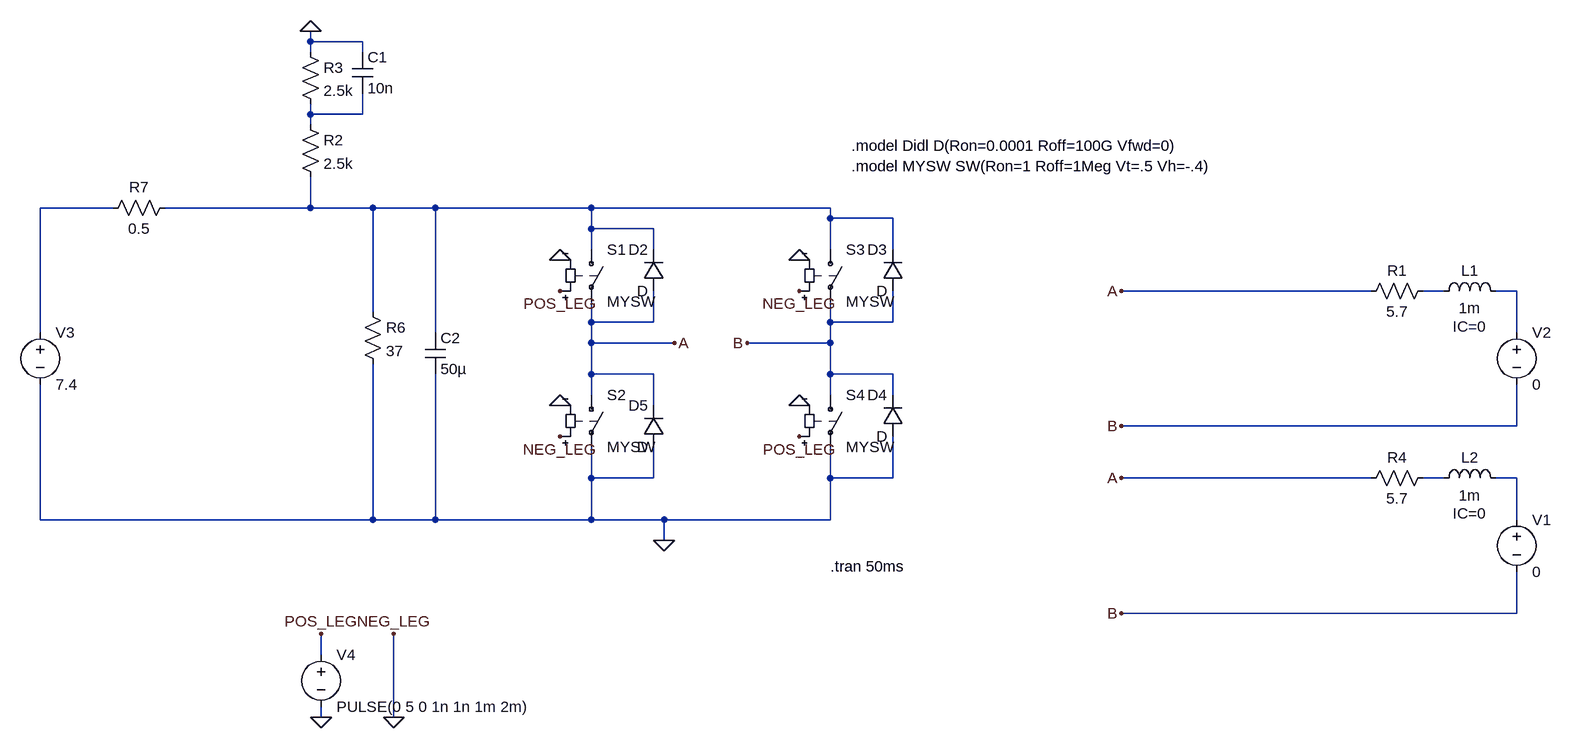
[diagram p0: schematic current-reading.asc]
current-reading.asc, the LTspice schematic file:
Version 4
SHEET 1 1304 740
WIRE -768 -416 -768 -432
WIRE -688 -416 -768 -416
WIRE -768 -400 -768 -416
WIRE -688 -400 -688 -416
WIRE -768 -304 -768 -320
WIRE -688 -304 -688 -336
WIRE -688 -304 -768 -304
WIRE -768 -288 -768 -304
WIRE -1072 -160 -1184 -160
WIRE -768 -160 -768 -208
WIRE -768 -160 -992 -160
WIRE -672 -160 -768 -160
WIRE -576 -160 -672 -160
WIRE -336 -160 -576 -160
WIRE 32 -160 -336 -160
WIRE 32 -144 32 -160
WIRE 128 -144 32 -144
WIRE -336 -128 -336 -160
WIRE -240 -128 -336 -128
WIRE -336 -96 -336 -128
WIRE -240 -96 -240 -128
WIRE 32 -96 32 -144
WIRE 128 -96 128 -144
WIRE 864 -32 480 -32
WIRE 976 -32 944 -32
WIRE 1088 -32 1056 -32
WIRE -672 0 -672 -160
WIRE -336 16 -336 -16
WIRE -240 16 -240 -32
WIRE -240 16 -336 16
WIRE 32 16 32 -16
WIRE 128 16 128 -32
WIRE 128 16 32 16
WIRE -1184 32 -1184 -160
WIRE -576 32 -576 -160
WIRE 1088 32 1088 -32
WIRE -336 48 -336 16
WIRE -208 48 -336 48
WIRE 32 48 32 16
WIRE 32 48 -96 48
WIRE -336 96 -336 48
WIRE -240 96 -336 96
WIRE 32 96 32 48
WIRE 128 96 32 96
WIRE -336 128 -336 96
WIRE 32 128 32 96
WIRE 128 128 128 96
WIRE -240 144 -240 96
WIRE 1088 176 1088 112
WIRE 1088 176 480 176
WIRE -336 256 -336 208
WIRE -240 256 -240 208
WIRE -240 256 -336 256
WIRE 32 256 32 208
WIRE 128 256 128 192
WIRE 128 256 32 256
WIRE 864 256 480 256
WIRE 976 256 944 256
WIRE 1088 256 1056 256
WIRE -1184 320 -1184 112
WIRE -672 320 -672 80
WIRE -672 320 -1184 320
WIRE -576 320 -576 96
WIRE -576 320 -672 320
WIRE -336 320 -336 256
WIRE -336 320 -576 320
WIRE -224 320 -336 320
WIRE 32 320 32 256
WIRE 32 320 -224 320
WIRE 1088 320 1088 256
WIRE -224 352 -224 320
WIRE 1088 464 1088 400
WIRE 1088 464 480 464
WIRE -752 528 -752 496
WIRE -752 624 -752 608
WIRE -640 624 -640 496
FLAG -224 352 0
FLAG -384 -80 0
FLAG -384 144 0
FLAG -16 144 0
FLAG -16 -80 0
FLAG -640 624 0
FLAG -752 624 0
FLAG -752 496 POS_LEG
FLAG -640 496 NEG_LEG
FLAG -384 -32 POS_LEG
FLAG -16 192 POS_LEG
FLAG -384 192 NEG_LEG
FLAG -16 -32 NEG_LEG
FLAG -208 48 A
FLAG -96 48 B
FLAG 480 -32 A
FLAG 480 176 B
FLAG -768 -432 0
FLAG 480 256 A
FLAG 480 464 B
SYMBOL voltage 1088 16 R0
WINDOW 123 0 0 Left 0
WINDOW 39 0 0 Left 0
SYMATTR InstName V2
SYMATTR Value 0
SYMBOL res 960 -48 R90
WINDOW 0 0 56 VBottom 2
WINDOW 3 32 56 VTop 2
SYMATTR InstName R1
SYMATTR Value 5.7
SYMBOL ind 960 -16 R270
WINDOW 0 32 56 VTop 2
WINDOW 3 5 56 VBottom 2
WINDOW 39 -23 56 VBottom 2
SYMATTR InstName L1
SYMATTR Value 1m
SYMATTR SpiceLine IC=0
SYMBOL sw -336 -112 R0
SYMATTR InstName S1
SYMATTR Value MYSW
SYMBOL sw -336 112 R0
SYMATTR InstName S2
SYMATTR Value MYSW
SYMBOL sw 32 -112 R0
SYMATTR InstName S3
SYMATTR Value MYSW
SYMBOL sw 32 112 R0
SYMATTR InstName S4
SYMATTR Value MYSW
SYMBOL voltage -1184 16 R0
WINDOW 123 0 0 Left 0
WINDOW 39 0 0 Left 0
SYMATTR InstName V3
SYMATTR Value 7.4
SYMBOL diode -224 -32 R180
WINDOW 0 24 64 Left 2
WINDOW 3 24 0 Left 2
SYMATTR InstName D2
SYMBOL diode 144 -32 R180
WINDOW 0 24 64 Left 2
WINDOW 3 24 0 Left 2
SYMATTR InstName D3
SYMBOL diode 144 192 R180
WINDOW 0 24 64 Left 2
WINDOW 3 24 0 Left 2
SYMATTR InstName D4
SYMBOL diode -224 208 R180
WINDOW 0 24 64 Left 2
WINDOW 3 24 0 Left 2
SYMATTR InstName D5
SYMBOL voltage -752 512 R0
WINDOW 123 0 0 Left 0
WINDOW 39 0 0 Left 0
SYMATTR InstName V4
SYMATTR Value PULSE(0 5 0 1n 1n 1m 2m)
SYMBOL res -976 -176 R90
WINDOW 0 0 56 VBottom 2
WINDOW 3 32 56 VTop 2
SYMATTR InstName R7
SYMATTR Value 0.5
SYMBOL res -784 -304 R0
SYMATTR InstName R2
SYMATTR Value 2.5k
SYMBOL res -784 -416 R0
SYMATTR InstName R3
SYMATTR Value 2.5k
SYMBOL cap -704 -400 R0
SYMATTR InstName C1
SYMATTR Value 10n
SYMBOL cap -592 32 R0
SYMATTR InstName C2
SYMATTR Value 50µ
SYMBOL voltage 1088 304 R0
WINDOW 123 0 0 Left 0
WINDOW 39 0 0 Left 0
SYMATTR InstName V1
SYMATTR Value 0
SYMBOL res 960 240 R90
WINDOW 0 0 56 VBottom 2
WINDOW 3 32 56 VTop 2
SYMATTR InstName R4
SYMATTR Value 5.7
SYMBOL ind 960 272 R270
WINDOW 0 32 56 VTop 2
WINDOW 3 5 56 VBottom 2
WINDOW 39 -23 56 VBottom 2
SYMATTR InstName L2
SYMATTR Value 1m
SYMATTR SpiceLine IC=0
SYMBOL res -688 -16 R0
SYMATTR InstName R6
SYMATTR Value 37
TEXT 32 392 Left 2 !.tran 50ms
TEXT 64 -224 Left 2 !.model MYSW SW(Ron=1 Roff=1Meg Vt=.5 Vh=-.4)
TEXT 64 -256 Left 2 !.model Didl D(Ron=0.0001 Roff=100G Vfwd=0)

The netlist it stands for:
* current-reading.asc
V2 N005 B 0
R1 N004 A 5.7
L1 N004 N005 1m IC=0
S1 N003 A POS_LEG 0 MYSW
S2 A 0 0 0 MYSW
S3 N003 B 0 0 MYSW
S4 B 0 POS_LEG 0 MYSW
V3 N002 0 7.4
D2 A N003 D
D3 B N003 D
D4 0 B D
D5 0 A D
V4 POS_LEG 0 PULSE(0 5 0 1n 1n 1m 2m)
R7 N003 N002 0.5
R2 N001 N003 2.5k
R3 0 N001 2.5k
C1 0 N001 10n
C2 N003 0 50µ
V1 N007 B 0
R4 N006 A 5.7
L2 N006 N007 1m IC=0
R6 N003 0 37
.model D D
.lib standard.dio
.tran 50ms
.model MYSW SW(Ron=1 Roff=1Meg Vt=.5 Vh=-.4)
.model Didl D(Ron=0.0001 Roff=100G Vfwd=0)
.backanno
.end